# Altium project LED Shield.PrjPcb
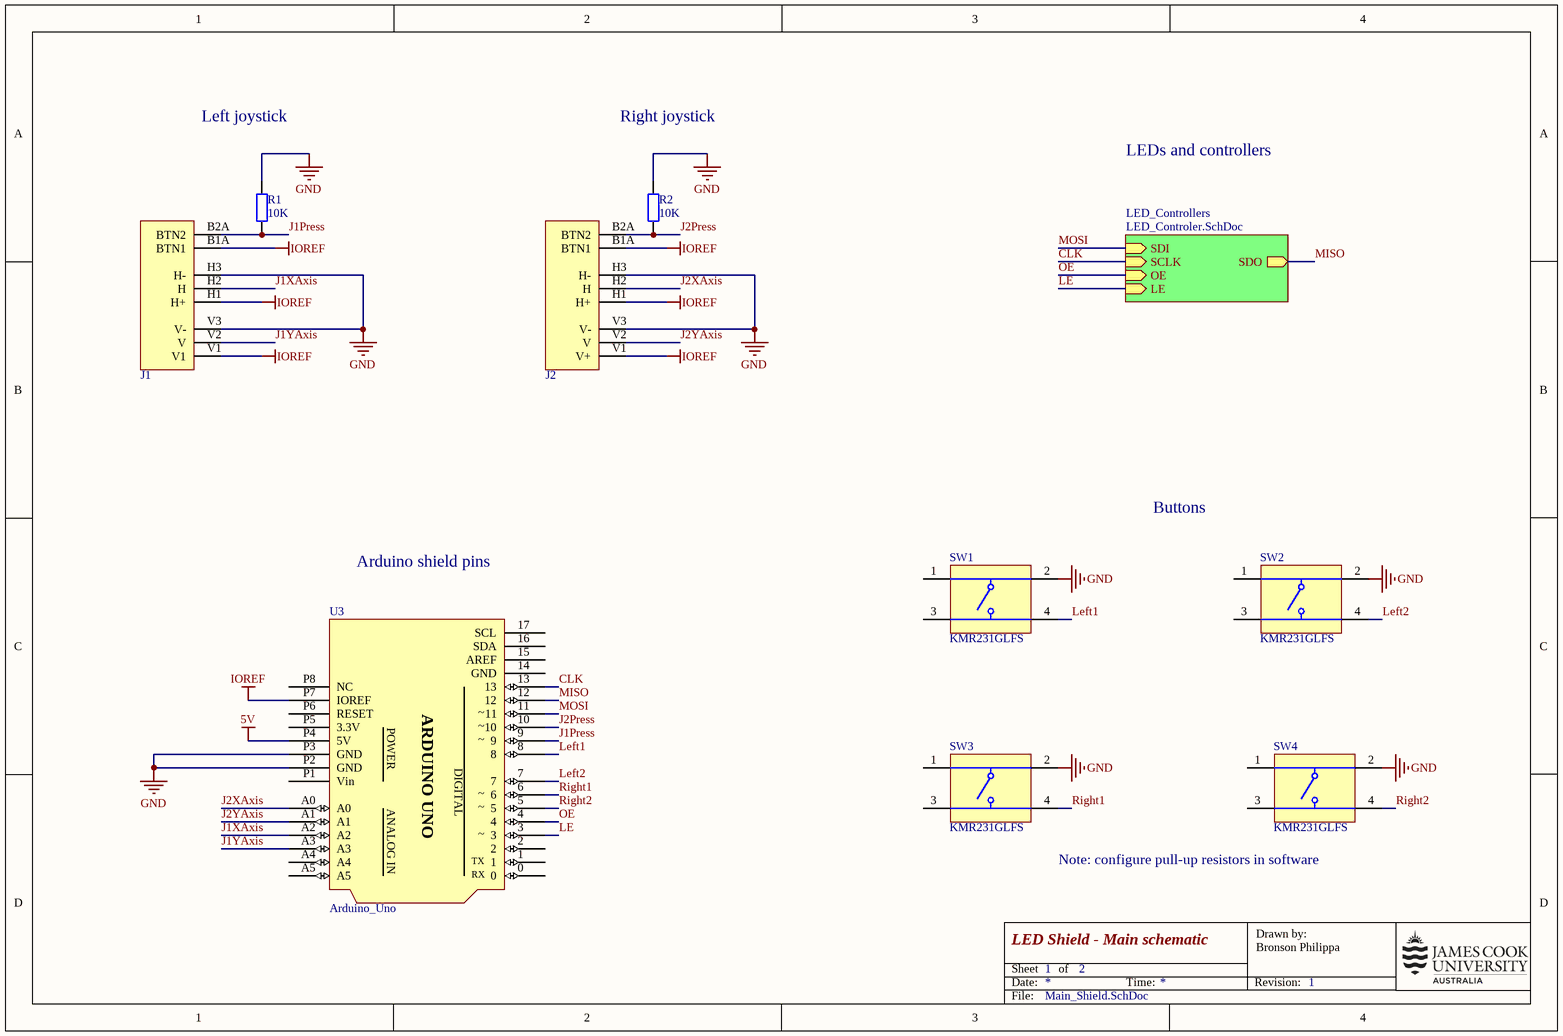
[diagram p0: Main_Shield.SchDoc]
2 sheets, 47 parts. Net scope: hierarchical (ports join the sheet entries above them; power ports are global).
Board file: PCB Rev 1.PcbDoc
Sheets:
  Main_Shield.SchDoc
    LED_Controllers = LED_Controler.SchDoc

## Sheet Main_Shield.SchDoc: LED Shield - Main schematic
size A4; DrawnBy: Bronson Philippa; Revision: 1; SheetNumber: 1; SheetTotal: 2

### Parts
J1  Joystick  [JOYSTICK]  (value not drawn)
J2  Joystick  [JOYSTICK]  (value not drawn)
R1  value 10K  [AXIAL-0.4]  (hidden comment: Resistor Axial-0.4)
R2  value 10K  [AXIAL-0.4]  (hidden comment: Resistor Axial-0.4)
SW1  KMR231GLFS  [CKCP-KMR231GLFS]
SW2  KMR231GLFS  [CKCP-KMR231GLFS]
SW3  KMR231GLFS  [CKCP-KMR231GLFS]
SW4  KMR231GLFS  [CKCP-KMR231GLFS]
U3  Arduino_Uno  [ArduinoUnoR3]

### Sub-sheets
LED_Controllers = LED_Controler.SchDoc: SDO (out), SDI (in), SCLK (in), OE (in), LE (in)

### Nets
5V: U3.P4(5V)
GND: J1.H3(H-) J1.V3(V-) J2.H3(H-) J2.V3(V-) R1.1 R2.1 SW1.2 SW2.2 SW3.2 SW4.2 U3.P2(GND) U3.P3(GND)
IOREF: J1.B1A(BTN1) J1.H1(H+) J1.V1 J2.B1A(BTN1) J2.H1(H+) J2.V1(V+) U3.P7(IOREF)
CLK: U3.13 ; sheet LED_Controllers/SCLK
J1Press: J1.B2A(BTN2) R1.2 U3.9
J1XAxis: J1.H2(H) U3.A2
J1YAxis: J1.V2(V) U3.A3
J2Press: J2.B2A(BTN2) R2.2 U3.10
J2XAxis: J2.H2(H) U3.A0
J2YAxis: J2.V2(V) U3.A1
LE: U3.3 ; sheet LED_Controllers/LE
Left1: SW1.4 U3.8
Left2: SW2.4 U3.7
MISO: U3.12 ; sheet LED_Controllers/SDO
MOSI: U3.11 ; sheet LED_Controllers/SDI
OE: U3.4 ; sheet LED_Controllers/OE
Right1: SW3.4 U3.6
Right2: SW4.4 U3.5

Not connected (* = marked no-connect by the designer): SW1 1 3; SW2 1 3; SW3 1 3; SW4 1 3; U3 0 1 2 14(GND) 15(AREF) 16(SDA) 17(SCL) A4 A5 P1(Vin) P5(3.3V) P6(RESET) P8(NC)

### Notes on the sheet
- Left joystick
- Right joystick
- LEDs and controllers
- Buttons
- Arduino shield pins
- Note: configure pull-up resistors in software
- Date:
- Sheet
- of
- Time:
- Revision:
- Drawn by:
- File:
- (in symbol Arduino_Uno) ARDUINO UNO; ~; POWER; DIGITAL; ANALOG IN; TX; RX

### Library data of the parts
J1 J2 = Joystick: Sparkfun Joystick COM-09032
R1 R2 = Resistor Axial-0.4: Resistor; Published: 8-Jun-2000; LatestRevisionDate: 17-Jul-2002; LatestRevisionNote: Re-released for DXP Platform.; PackageReference: AXIAL-0.4; Publisher: Altium Limited; PackageDescription: Axial Device, Thru-Hole; 2 Leads; 0.4 in Pin Spacing
SW1-SW4 = CMP-2000-06516-1: Switch Tactile, SPST, 50 mA, 32 V, -40 to 85 degC, 4-Pin SMD, RoHS, Tape and Reel; Manufacturer: C&K Components; Mechanical Life: 150000Cycles; Switch Configuration: N.O.; Actuator Style: Button; Ground Terminal: Yes; Maximum DC Voltage Rating: 32V; Minimum Insulation Resistance: >=1000MOhm; Dielectric Strength: >=250Vrms; Operating Force: 3N; Illumination Type: N/R; Body Orientation: Straight; Contact Rating @ Voltage: 1A; Actuator Length: 0.5mm; Operating Temperature: -40to85C; Electrical Life: N/A; Housing Material: N/A; ECCN: EAR99; Pole Throw Configuration: SPST; Contact Plating: Silver; Dimension: 2.8x4.6x1.9mm; Type: Micro-Miniature; Product Weight: N/A; Package Description: 4-Pin Surface Mount Device, Body 4.6 x 2.8 mm; Actuator Color: N/A; HTS: 8536501199; Mounting Technology: SurfaceMount; Mounting: SurfaceMount,GullWing; Seal Location: N/A; Base Material: N/A; Family: KMR2; Part No: KMR231GLFS; Datasheet Version: 06/2016; Contact Material: Silver; Package Reference: KMR231GLFS; Manufacturer URL: http://www.ckswitches.com/; Maximum AC Voltage Rating: N/A; Datasheet URL: http://www.ck-components.com/media/1479/kmr2.pdf; RoHS: Yes; Seal Description: N/A; Packaging: TapeandReel; Supplier: C&KComponents
U3 = Arduino_Uno: Template for building an Arduino shield

## Sheet LED_Controler.SchDoc: LED Shield - LED controllers
size A4; DrawnBy: Bronson Philippa; Revision: 1; SheetNumber: 2; SheetTotal: 2
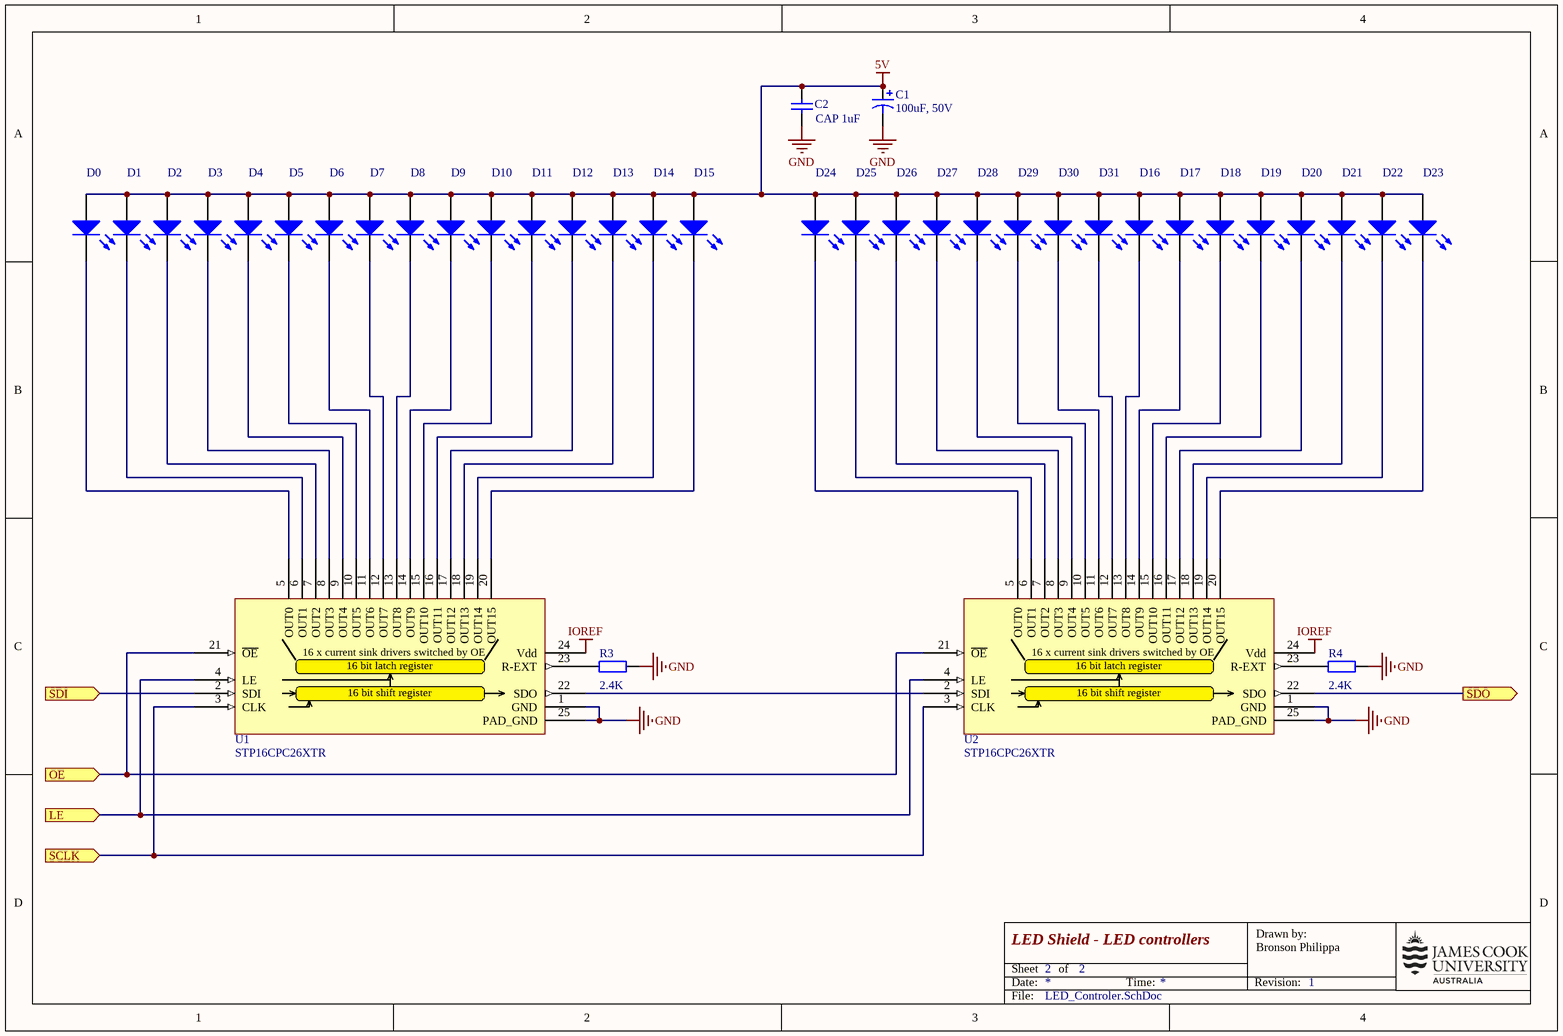
[diagram p1: LED_Controler.SchDoc]

### Parts
C1  100uF, 50V  [Capacitor radial 8mm]
C2  CAP 1uF  [CAPC1206(3216)130_M]
D0  LED3  [3.5X2.8X1.9]  (value not drawn)
D1  LED3  [3.5X2.8X1.9]  (value not drawn)
D2  LED3  [3.5X2.8X1.9]  (value not drawn)
D3  LED3  [3.5X2.8X1.9]  (value not drawn)
D4  LED3  [3.5X2.8X1.9]  (value not drawn)
D5  LED3  [3.5X2.8X1.9]  (value not drawn)
D6  LED3  [3.5X2.8X1.9]  (value not drawn)
D7  LED3  [3.5X2.8X1.9]  (value not drawn)
D8  LED3  [3.5X2.8X1.9]  (value not drawn)
D9  LED3  [3.5X2.8X1.9]  (value not drawn)
D10  LED3  [3.5X2.8X1.9]  (value not drawn)
D11  LED3  [3.5X2.8X1.9]  (value not drawn)
D12  LED3  [3.5X2.8X1.9]  (value not drawn)
D13  LED3  [3.5X2.8X1.9]  (value not drawn)
D14  LED3  [3.5X2.8X1.9]  (value not drawn)
D15  LED3  [3.5X2.8X1.9]  (value not drawn)
D16  LED3  [3.5X2.8X1.9]  (value not drawn)
D17  LED3  [3.5X2.8X1.9]  (value not drawn)
D18  LED3  [3.5X2.8X1.9]  (value not drawn)
D19  LED3  [3.5X2.8X1.9]  (value not drawn)
D20  LED3  [3.5X2.8X1.9]  (value not drawn)
D21  LED3  [3.5X2.8X1.9]  (value not drawn)
D22  LED3  [3.5X2.8X1.9]  (value not drawn)
D23  LED3  [3.5X2.8X1.9]  (value not drawn)
D24  LED3  [3.5X2.8X1.9]  (value not drawn)
D25  LED3  [3.5X2.8X1.9]  (value not drawn)
D26  LED3  [3.5X2.8X1.9]  (value not drawn)
D27  LED3  [3.5X2.8X1.9]  (value not drawn)
D28  LED3  [3.5X2.8X1.9]  (value not drawn)
D29  LED3  [3.5X2.8X1.9]  (value not drawn)
D30  LED3  [3.5X2.8X1.9]  (value not drawn)
D31  LED3  [3.5X2.8X1.9]  (value not drawn)
R3  value 2.4K  [AXIAL-0.4]  (hidden comment: Res2)
R4  value 2.4K  [AXIAL-0.4]  (hidden comment: Res2)
U1  STP16CPC26XTR  [STP16CPC26XTR TSSOP-24]
U2  STP16CPC26XTR  [STP16CPC26XTR TSSOP-24]

### Ports
LE (in), OE (in), SCLK (in), SDI (in), SDO (out)

### Nets
5V: C1.1 C2.1 D0.1(A) D1.1(A) D2.1(A) D3.1(A) D4.1(A) D5.1(A) D6.1(A) D7.1(A) D8.1(A) D9.1(A) D10.1(A) D11.1(A) D12.1(A) D13.1(A) D14.1(A) D15.1(A) D16.1(A) D17.1(A) D18.1(A) D19.1(A) D20.1(A) D21.1(A) D22.1(A) D23.1(A) D24.1(A) D25.1(A) D26.1(A) D27.1(A) D28.1(A) D29.1(A) D30.1(A) D31.1(A)
GND: C1.2 C2.2 R3.2 R4.2 U1.1(GND) U1.25(PAD_GND) U2.1(GND) U2.25(PAD_GND)
IOREF: U1.24(Vdd) U2.24(Vdd)
CLK: U1.3(CLK) U2.3(CLK) ; port SCLK
LE: U1.4(LE) U2.4(LE) ; port LE
MISO: U2.22(SDO) ; port SDO
MOSI: U1.2(SDI) ; port SDI
OE: U1.21(~{OE}) U2.21(~{OE}) ; port OE
NetD0_2: D0.2(K) U1.5(OUT0)
NetD1_2: D1.2(K) U1.6(OUT1)
NetD2_2: D2.2(K) U1.7(OUT2)
NetD3_2: D3.2(K) U1.8(OUT3)
NetD4_2: D4.2(K) U1.9(OUT4)
NetD5_2: D5.2(K) U1.10(OUT5)
NetD6_2: D6.2(K) U1.11(OUT6)
NetD7_2: D7.2(K) U1.12(OUT7)
NetD8_2: D8.2(K) U1.13(OUT8)
NetD9_2: D9.2(K) U1.14(OUT9)
NetD10_2: D10.2(K) U1.15(OUT10)
NetD11_2: D11.2(K) U1.16(OUT11)
NetD12_2: D12.2(K) U1.17(OUT12)
NetD13_2: D13.2(K) U1.18(OUT13)
NetD14_2: D14.2(K) U1.19(OUT14)
NetD15_2: D15.2(K) U1.20(OUT15)
NetD16_2: D16.2(K) U2.13(OUT8)
NetD17_2: D17.2(K) U2.14(OUT9)
NetD18_2: D18.2(K) U2.15(OUT10)
NetD19_2: D19.2(K) U2.16(OUT11)
NetD20_2: D20.2(K) U2.17(OUT12)
NetD21_2: D21.2(K) U2.18(OUT13)
NetD22_2: D22.2(K) U2.19(OUT14)
NetD23_2: D23.2(K) U2.20(OUT15)
NetD24_2: D24.2(K) U2.5(OUT0)
NetD25_2: D25.2(K) U2.6(OUT1)
NetD26_2: D26.2(K) U2.7(OUT2)
NetD27_2: D27.2(K) U2.8(OUT3)
NetD28_2: D28.2(K) U2.9(OUT4)
NetD29_2: D29.2(K) U2.10(OUT5)
NetD30_2: D30.2(K) U2.11(OUT6)
NetD31_2: D31.2(K) U2.12(OUT7)
NetR3_1: R3.1 U1.23(R-EXT)
NetR4_1: R4.1 U2.23(R-EXT)
NetU1_22: U1.22(SDO) U2.2(SDI)

### Notes on the sheet
- Date:
- Sheet
- of
- Time:
- Revision:
- Drawn by:
- File:
- (in symbol LED sink driver 16 ch STP16CPC26XTR) 16 x current sink drivers switched by OE; 16 bit latch register; 16 bit shift register

### Library data of the parts
C1 = Cap 100uF, 50V, THT radial: Electrolytic Capacitor, 100 µF, 50 V, ± 20%, Radial Leaded, 8 mm
C2 = CMP-1037-04700-1: CAP 1uF 25V ±10% 1206 (3216 Metric) Thickness 1.3mm SMD; Tolerance: Â±10%; Case-Metric: 3216; Case-EIA: 1206; Value: 1uF; Rated Voltage: 25 V; Max Thickness: 1.3 mm; Technology: SMT
D0-D31 = LED3: Typical BLUE SiC LED; Published: 8-Jun-2000; LatestRevisionDate: 17-Dec-2003; LatestRevisionNote: PCB Footprint replaced.; DatasheetVersion: 16-Apr-2002; PackageVersion: 16-Apr-2002; PackageReference: 3.5X2.8X1.9; Publisher: Altium Limited; PackageDescription: SM LED; 2 C-Bend Leads; Body 3.5 x 2.8 x 1.9 mm, inc leads (LxWxH typ)
R3 R4 = Res2: Resistor; Published: 8-Jun-2000; LatestRevisionDate: 17-Jul-2002; LatestRevisionNote: Re-released for DXP Platform.; PackageReference: AXIAL-0.4; Publisher: Altium Limited; PackageDescription: Axial Device, Thru-Hole; 2 Leads; 0.4 in Pin Spacing
U1 U2 = LED sink driver 16 ch STP16CPC26XTR: ST Microelectronics STP16CPC26XTR constant current LED sink driver; Supplier 1: element14 APAC; Supplier Part Number 1: 2460710; Supplier 2: Digikey; Supplier 3: Newark; Supplier Part Number 2: 497-11984-1-ND; Supplier Part Number 3: 38Y7958

## Nets that join several sheets
5V: Main_Shield (U3.P4), LED_Controler (34 pins)
GND: Main_Shield (12 pins), LED_Controler (8 pins)
IOREF: Main_Shield (7 pins), LED_Controler (U1.24 U2.24)
CLK: Main_Shield (U3.13), LED_Controler (U1.3 U2.3)
LE: Main_Shield (U3.3), LED_Controler (U1.4 U2.4)
MISO: Main_Shield (U3.12), LED_Controler (U2.22)
MOSI: Main_Shield (U3.11), LED_Controler (U1.2)
OE: Main_Shield (U3.4), LED_Controler (U1.21 U2.21)